# EAGLE design Breadboard_v11 (EAGLE 9.6.2)
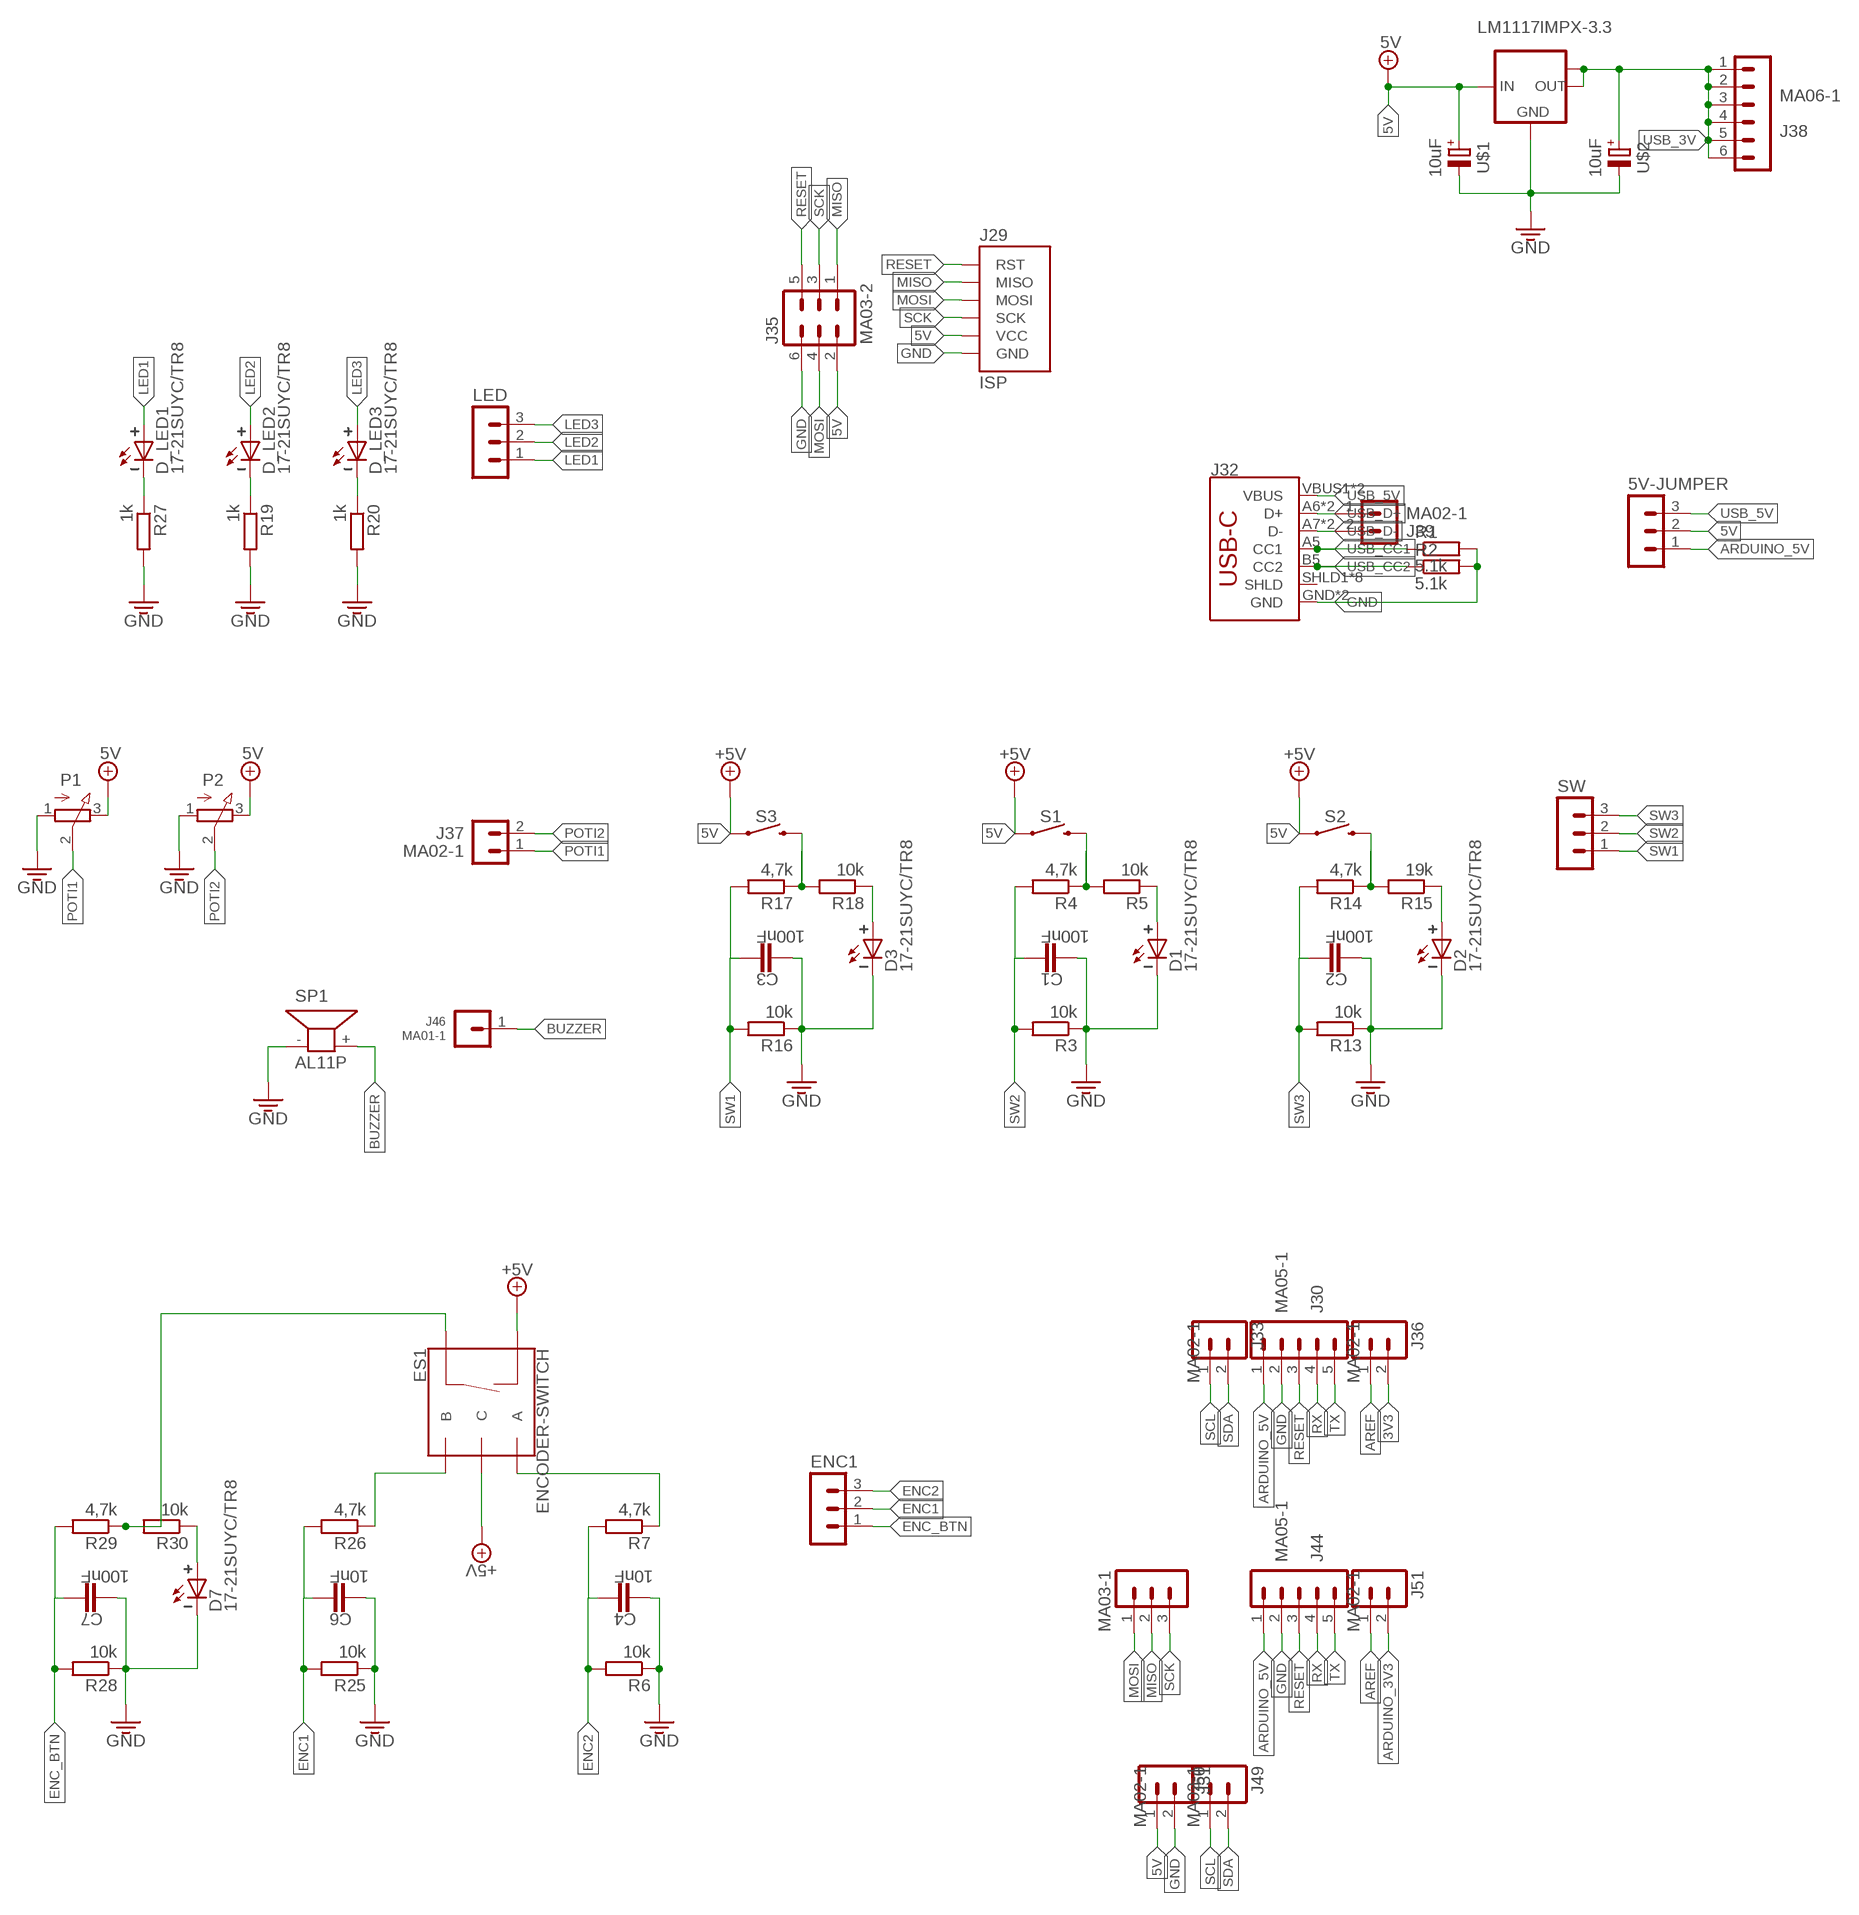
[diagram p0: schematic, sheet 1, part 1 of 2]
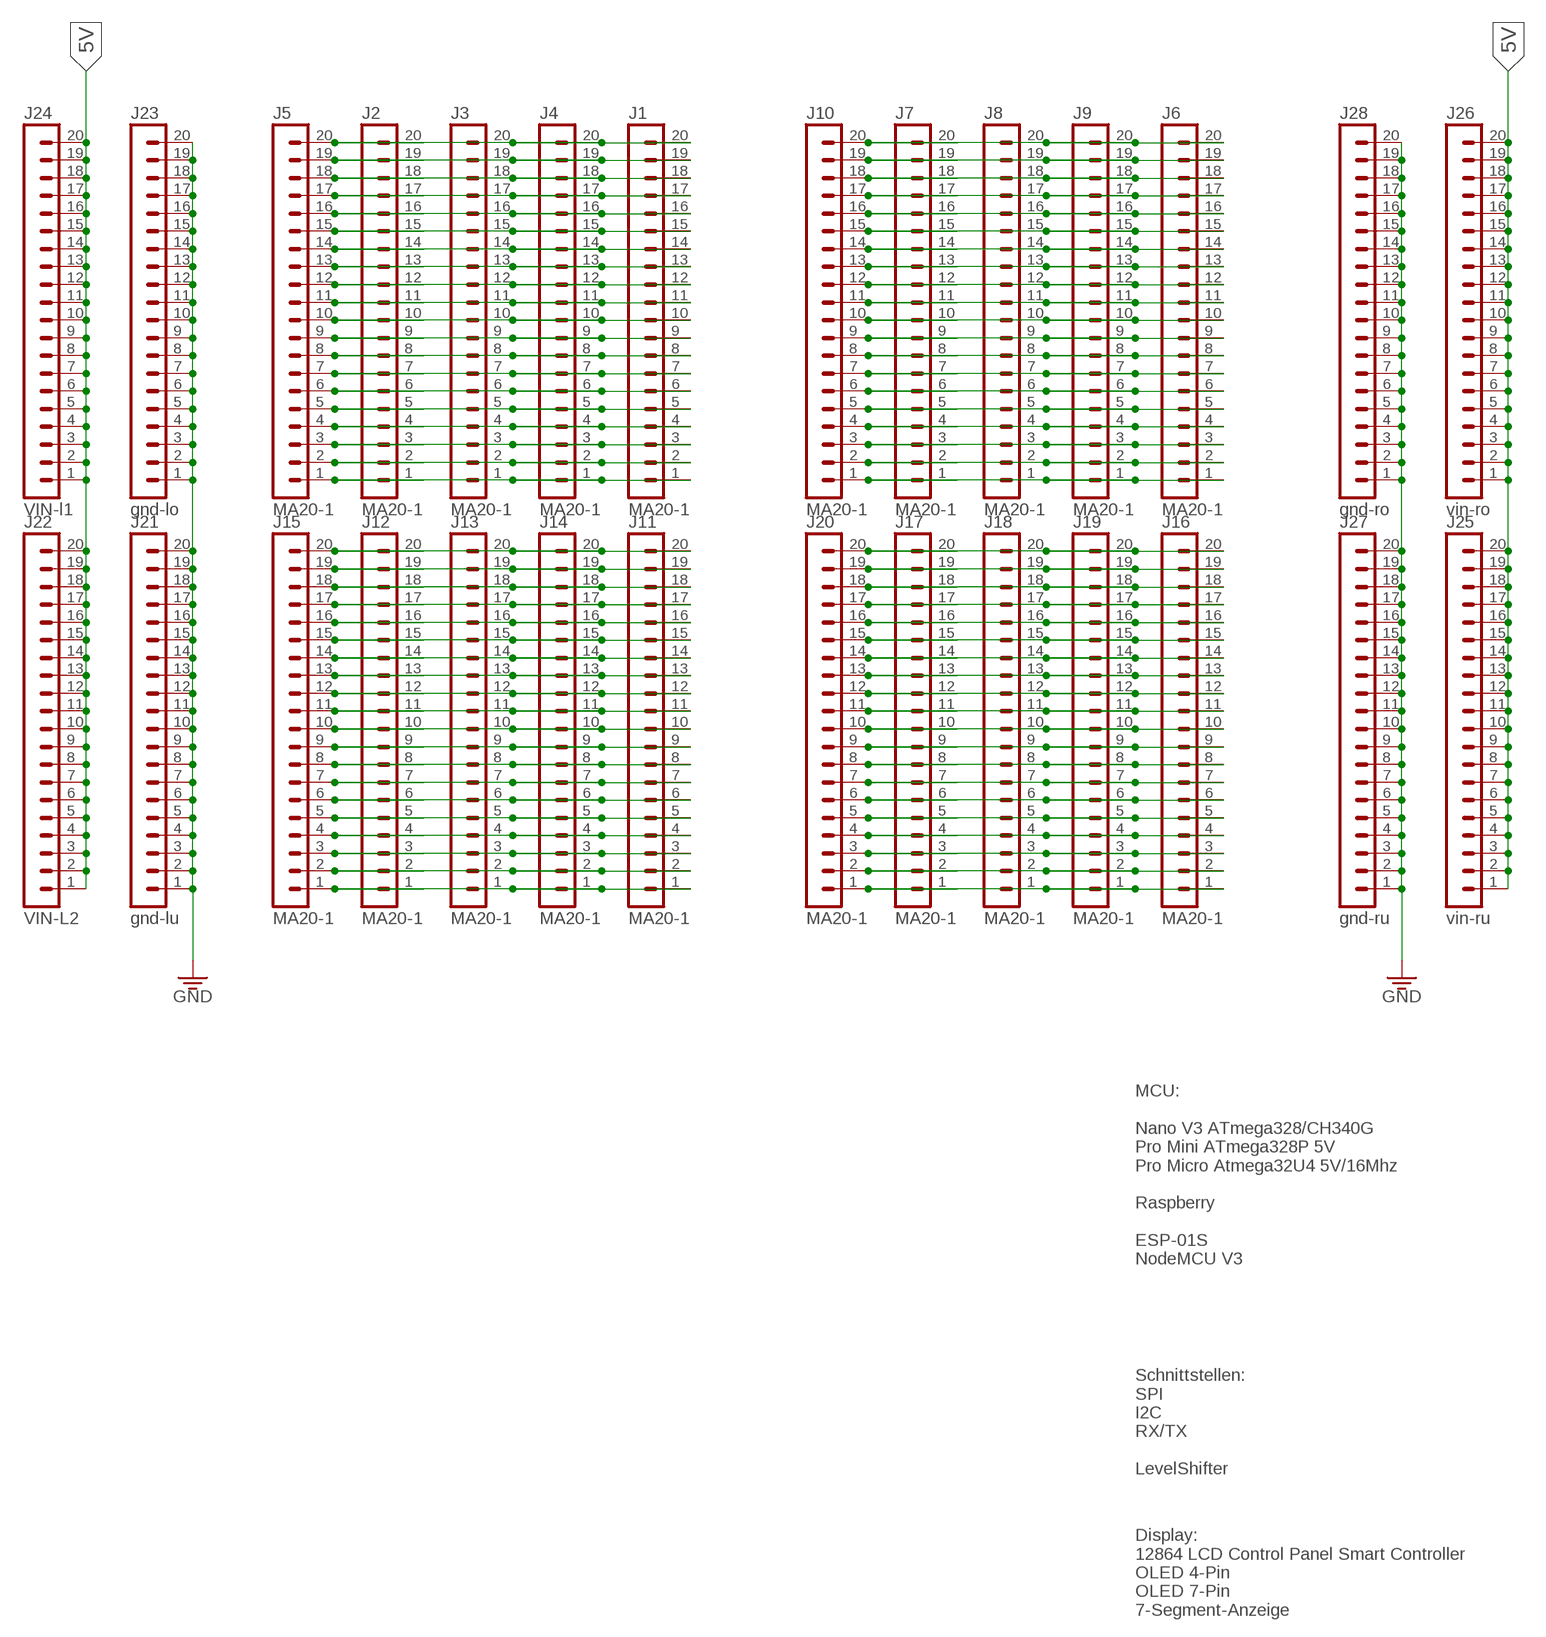
[diagram p1: schematic, sheet 1, part 2 of 2]

## Parts
5V-JUMPER  MA03-1  [MA03-1]
C1  100nF  C-EUC0805  [C0805]
C2  100nF  C-EUC0805  [C0805]
C3  100nF  C-EUC0805  [C0805]
C4  10nF  C-EUC0805  [C0805]
C6  10nF  C-EUC0805  [C0805]
C7  100nF  C-EUC0805  [C0805]
D1  17-21SUYC/TR8  LED-3MM  [LED_3MM]
D2  17-21SUYC/TR8  LED-3MM  [LED_3MM]
D3  17-21SUYC/TR8  LED-3MM  [LED_3MM]
D7  17-21SUYC/TR8  LED-3MM  [LED_3MM]
D_LED1  17-21SUYC/TR8  LED-3MM  [LED_3MM]
D_LED2  17-21SUYC/TR8  LED-3MM  [LED_3MM]
D_LED3  17-21SUYC/TR8  LED-3MM  [LED_3MM]
ENC1  MA03-1  [MA03-1]
ES1  ENCODER-SWITCH  [ROTARY_ENC_PLAIN]
IC2  LM1117IMPX-3.3  [SOT223]
J1  MA20-1  [MA20-1]
J2  MA20-1  [MA20-1]
J3  MA20-1  [MA20-1]
J4  MA20-1  [MA20-1]
J5  MA20-1  [MA20-1]
J6  MA20-1  [MA20-1]
J7  MA20-1  [MA20-1]
J8  MA20-1  [MA20-1]
J9  MA20-1  [MA20-1]
J10  MA20-1  [MA20-1]
J11  MA20-1  [MA20-1]
J12  MA20-1  [MA20-1]
J13  MA20-1  [MA20-1]
J14  MA20-1  [MA20-1]
J15  MA20-1  [MA20-1]
J16  MA20-1  [MA20-1]
J17  MA20-1  [MA20-1]
J18  MA20-1  [MA20-1]
J19  MA20-1  [MA20-1]
J20  MA20-1  [MA20-1]
J21  gnd-lu  MA20-1  [MA20-1]
J22  VIN-L2  MA20-1  [MA20-1]
J23  gnd-lo  MA20-1  [MA20-1]
J24  VIN-l1  MA20-1  [MA20-1]
J25  vin-ru  MA20-1  [MA20-1]
J26  vin-ro  MA20-1  [MA20-1]
J27  gnd-ru  MA20-1  [MA20-1]
J28  gnd-ro  MA20-1  [MA20-1]
J29  ISP  [ISP-2X3]
J30  MA05-1  [MA05-1]
J31  MA02-1  [MA02-1]
J32  USB_C16PIN  [USB-C-16P]
J33  MA02-1  [MA02-1]
J35  MA03-2  [MA03-2]
J36  MA02-1  [MA02-1]
J37  MA02-1  [MA02-1]
J38  MA06-1  [MA06-1]
J39  MA02-1  [MA02-1]
J44  MA05-1  [MA05-1]
J46  MA01-1  [MA01-1]
J49  MA02-1  [MA02-1]
J50  MA03-1  [MA03-1]
J51  MA02-1  [MA02-1]
LED  MA03-1  [MA03-1]
P1  3RP/1610N  [3RP/1610N]
P2  3RP/1610N  [3RP/1610N]
R1  5.1k  R-EU_R0805  [R0805]
R2  5.1k  R-EU_R0805  [R0805]
R3  10k  R-EU_R0805  [R0805]
R4  4,7k  R-EU_R0805  [R0805]
R5  10k  R-EU_R0805  [R0805]
R6  10k  R-EU_R0805  [R0805]
R7  4,7k  R-EU_R0805  [R0805]
R13  10k  R-EU_R0805  [R0805]
R14  4,7k  R-EU_R0805  [R0805]
R15  19k  R-EU_R0805  [R0805]
R16  10k  R-EU_R0805  [R0805]
R17  4,7k  R-EU_R0805  [R0805]
R18  10k  R-EU_R0805  [R0805]
R19  1k  R-EU_R0805  [R0805]
R20  1k  R-EU_R0805  [R0805]
R25  10k  R-EU_R0805  [R0805]
R26  4,7k  R-EU_R0805  [R0805]
R27  1k  R-EU_R0805  [R0805]
R28  10k  R-EU_R0805  [R0805]
R29  4,7k  R-EU_R0805  [R0805]
R30  10k  R-EU_R0805  [R0805]
S1  MOMENTARY-SWITCH-SPST-PTH-12MM  [TACTILE_SWITCH_PTH_12MM]
S2  MOMENTARY-SWITCH-SPST-PTH-12MM  [TACTILE_SWITCH_PTH_12MM]
S3  MOMENTARY-SWITCH-SPST-PTH-12MM  [TACTILE_SWITCH_PTH_12MM]
SP1  AL11P  [AL11P]
SW  MA03-1  [MA03-1]
U$1  10uF  TANTALUM_10UF_16V  [C3216]
U$2  10uF  TANTALUM_10UF_16V  [C3216]

## Nets
3V3: J36.2
5V: 5V-JUMPER.2 ES1.C ES1.SW- IC2.3(IN) J22.1 J22.2 J22.3 J22.4 J22.5 J22.6 J22.7 J22.8 J22.9 J22.10 J22.11 J22.12 J22.13 J22.14 J22.15 J22.16 J22.17 J22.18 J22.19 J22.20 J24.1 J24.2 J24.3 J24.4 J24.5 J24.6 J24.7 J24.8 J24.9 J24.10 J24.11 J24.12 J24.13 J24.14 J24.15 J24.16 J24.17 J24.18 J24.19 J24.20 J25.1 J25.2 J25.3 J25.4 J25.5 J25.6 J25.7 J25.8 J25.9 J25.10 J25.11 J25.12 J25.13 J25.14 J25.15 J25.16 J25.17 J25.18 J25.19 J25.20 J26.1 J26.2 J26.3 J26.4 J26.5 J26.6 J26.7 J26.8 J26.9 J26.10 J26.11 J26.12 J26.13 J26.14 J26.15 J26.16 J26.17 J26.18 J26.19 J26.20 J29.VCC J31.1 J35.2 P1.3(E) P2.3(E) S1.1 S2.1 S3.1 U$1.1(+) ; supply symbol labelled +5V
ARDUINO_3V3: J51.2
ARDUINO_5V: 5V-JUMPER.1 J30.1 J44.1
AREF: J36.1 J51.1
BUZZER: J46.1 SP1.+
ENC1: C6.1 ENC1.2 R25.2 R26.2
ENC2: C4.1 ENC1.3 R6.2 R7.2
ENC_BTN: C7.1 ENC1.1 R28.2 R29.2
GND: C1.2 C2.2 C3.2 C4.2 C6.2 C7.2 D1.C D2.C D3.C D7.C IC2.1(GND) J21.1 J21.2 J21.3 J21.4 J21.5 J21.6 J21.7 J21.8 J21.9 J21.10 J21.11 J21.12 J21.13 J21.14 J21.15 J21.16 J21.17 J21.18 J21.19 J21.20 J23.1 J23.2 J23.3 J23.4 J23.5 J23.6 J23.7 J23.8 J23.9 J23.10 J23.11 J23.12 J23.13 J23.14 J23.15 J23.16 J23.17 J23.18 J23.19 J23.20 J27.1 J27.2 J27.3 J27.4 J27.5 J27.6 J27.7 J27.8 J27.9 J27.10 J27.11 J27.12 J27.13 J27.14 J27.15 J27.16 J27.17 J27.18 J27.19 J27.20 J28.1 J28.2 J28.3 J28.4 J28.5 J28.6 J28.7 J28.8 J28.9 J28.10 J28.11 J28.12 J28.13 J28.14 J28.15 J28.16 J28.17 J28.18 J28.19 J28.20 J29.GND J30.2 J31.2 J32.GND J32.GND2(GND) J35.6 J44.2 P1.1(A) P2.1(A) R1.2 R2.2 R3.1 R6.1 R13.1 R16.1 R19.2 R20.2 R25.1 R27.2 R28.1 SP1.- U$1.2(-) U$2.2(-)
LED1: D_LED1.A LED.1
LED2: D_LED2.A LED.2
LED3: D_LED3.A LED.3
LED+_$1: D1.A R5.1
LED+_$2: D2.A R15.1
LED+_$3: D3.A R18.1
LED+_$7: D7.A R30.1
MISO: J29.MISO J35.1 J50.2
MOSI: J29.MOSI J35.4 J50.1
N$1: J1.1 J2.1 J3.1 J4.1 J5.1
N$2: J1.2 J2.2 J3.2 J4.2 J5.2
N$3: J1.3 J2.3 J3.3 J4.3 J5.3
N$4: J1.4 J2.4 J3.4 J4.4 J5.4
N$5: J1.5 J2.5 J3.5 J4.5 J5.5
N$6: J1.6 J2.6 J3.6 J4.6 J5.6
N$7: J1.7 J2.7 J3.7 J4.7 J5.7
N$8: J1.8 J2.8 J3.8 J4.8 J5.8
N$9: J1.9 J2.9 J3.9 J4.9 J5.9
N$10: J1.10 J2.10 J3.10 J4.10 J5.10
N$11: J1.11 J2.11 J3.11 J4.11 J5.11
N$12: J1.12 J2.12 J3.12 J4.12 J5.12
N$13: J1.13 J2.13 J3.13 J4.13 J5.13
N$14: J1.14 J2.14 J3.14 J4.14 J5.14
N$15: J1.15 J2.15 J3.15 J4.15 J5.15
N$16: J1.16 J2.16 J3.16 J4.16 J5.16
N$17: J1.17 J2.17 J3.17 J4.17 J5.17
N$18: J1.18 J2.18 J3.18 J4.18 J5.18
N$19: J1.19 J2.19 J3.19 J4.19 J5.19
N$20: J1.20 J2.20 J3.20 J4.20 J5.20
N$21: J6.1 J7.1 J8.1 J9.1 J10.1
N$22: J6.2 J7.2 J8.2 J9.2 J10.2
N$23: J6.3 J7.3 J8.3 J9.3 J10.3
N$24: J6.4 J7.4 J8.4 J9.4 J10.4
N$25: J6.5 J7.5 J8.5 J9.5 J10.5
N$26: J6.6 J7.6 J8.6 J9.6 J10.6
N$27: J6.7 J7.7 J8.7 J9.7 J10.7
N$28: J6.8 J7.8 J8.8 J9.8 J10.8
N$29: J6.9 J7.9 J8.9 J9.9 J10.9
N$30: J6.10 J7.10 J8.10 J9.10 J10.10
N$31: J6.11 J7.11 J8.11 J9.11 J10.11
N$32: J6.12 J7.12 J8.12 J9.12 J10.12
N$33: J6.13 J7.13 J8.13 J9.13 J10.13
N$34: J6.14 J7.14 J8.14 J9.14 J10.14
N$35: J6.15 J7.15 J8.15 J9.15 J10.15
N$36: J6.16 J7.16 J8.16 J9.16 J10.16
N$37: J6.17 J7.17 J8.17 J9.17 J10.17
N$38: J6.18 J7.18 J8.18 J9.18 J10.18
N$39: J6.19 J7.19 J8.19 J9.19 J10.19
N$40: J6.20 J7.20 J8.20 J9.20 J10.20
N$41: J11.1 J12.1 J13.1 J14.1 J15.1
N$42: J11.2 J12.2 J13.2 J14.2 J15.2
N$43: J11.3 J12.3 J13.3 J14.3 J15.3
N$44: J11.4 J12.4 J13.4 J14.4 J15.4
N$45: J11.5 J12.5 J13.5 J14.5 J15.5
N$46: J11.6 J12.6 J13.6 J14.6 J15.6
N$47: J11.7 J12.7 J13.7 J14.7 J15.7
N$48: J11.8 J12.8 J13.8 J14.8 J15.8
N$49: J11.9 J12.9 J13.9 J14.9 J15.9
N$50: J11.10 J12.10 J13.10 J14.10 J15.10
N$51: J11.11 J12.11 J13.11 J14.11 J15.11
N$52: J11.12 J12.12 J13.12 J14.12 J15.12
N$53: J11.13 J12.13 J13.13 J14.13 J15.13
N$54: J11.14 J12.14 J13.14 J14.14 J15.14
N$55: J11.15 J12.15 J13.15 J14.15 J15.15
N$56: J11.16 J12.16 J13.16 J14.16 J15.16
N$57: J11.17 J12.17 J13.17 J14.17 J15.17
N$58: J11.18 J12.18 J13.18 J14.18 J15.18
N$59: J11.19 J12.19 J13.19 J14.19 J15.19
N$60: J11.20 J12.20 J13.20 J14.20 J15.20
N$61: J16.1 J17.1 J18.1 J19.1 J20.1
N$62: J16.2 J17.2 J18.2 J19.2 J20.2
N$63: J16.3 J17.3 J18.3 J19.3 J20.3
N$64: J16.4 J17.4 J18.4 J19.4 J20.4
N$65: J16.5 J17.5 J18.5 J19.5 J20.5
N$66: J16.6 J17.6 J18.6 J19.6 J20.6
N$67: J16.7 J17.7 J18.7 J19.7 J20.7
N$68: J16.8 J17.8 J18.8 J19.8 J20.8
N$69: J16.9 J17.9 J18.9 J19.9 J20.9
N$70: J16.10 J17.10 J18.10 J19.10 J20.10
N$71: J16.11 J17.11 J18.11 J19.11 J20.11
N$72: J16.12 J17.12 J18.12 J19.12 J20.12
N$73: J16.13 J17.13 J18.13 J19.13 J20.13
N$74: J16.14 J17.14 J18.14 J19.14 J20.14
N$75: J16.15 J17.15 J18.15 J19.15 J20.15
N$76: J16.16 J17.16 J18.16 J19.16 J20.16
N$77: J16.17 J17.17 J18.17 J19.17 J20.17
N$78: J16.18 J17.18 J18.18 J19.18 J20.18
N$79: J16.19 J17.19 J18.19 J19.19 J20.19
N$80: J16.20 J17.20 J18.20 J19.20 J20.20
N$81: R4.1 R5.2 S1.3
N$82: R14.1 R15.2 S2.3
N$83: R17.1 R18.2 S3.3
N$84: D_LED1.C R27.1
N$85: D_LED2.C R19.1
N$87: D_LED3.C R20.1
N$127: ES1.A R7.1
N$129: ES1.B R26.1
N$130: ES1.SW+ R29.1 R30.2
POTI1: J37.1 P1.2(S)
POTI2: J37.2 P2.2(S)
RESET: J29.RST J30.3 J35.5 J44.3
RX: J30.4 J44.4
SCK: J29.SCK J35.3 J50.3
SCL: J33.1 J49.1
SDA: J33.2 J49.2
SW1: C3.1 R16.2 R17.2 SW.1
SW2: C1.1 R3.2 R4.2 SW.2
SW3: C2.1 R13.2 R14.2 SW.3
TX: J30.5 J44.5
USB_3V: IC2.2(OUT) IC2.TAB(OUT1) J38.1 J38.2 J38.3 J38.4 J38.5 J38.6 U$2.1(+)
USB_5V: 5V-JUMPER.3 J32.VBUS1(VBUS) J32.VBUS2(VBUS)
USB_CC1: J32.A5(CC1) R1.1
USB_CC2: J32.B5(CC2) R2.1
USB_D+: J32.A6(D+) J32.B6(D+) J39.1
USB_D-: J32.A7(D-) J32.B7(D-) J39.2
Unconnected: J32.SHLD1(SHLD) J32.SHLD2(SHLD) J32.SHLD3(SHLD) J32.SHLD4(SHLD) J32.SHLD5(SHLD) J32.SHLD6(SHLD) J32.SHLD7(SHLD) J32.SHLD8(SHLD)

## Notes on the sheet
- MCU:
  
  Nano V3 ATmega328/CH340G
  Pro Mini ATmega328P 5V
  Pro Micro Atmega32U4 5V/16Mhz
  
  Raspberry
  
  ESP-01S
  NodeMCU V3
- Schnittstellen:
  SPI
  I2C
  RX/TX
  
  LevelShifter
- Display:
  12864 LCD Control Panel Smart Controller
  OLED 4-Pin
  OLED 7-Pin
  7-Segment-Anzeige

## Library data of the parts
5V-JUMPER ENC1 LED SW = 00_marph_CON2:MA03-1: Pin Header
C1-C4 C6 C7 = resistor:C-EU: CAPACITOR, European symbol
D1-D3 D7 D_LED1-D_LED3 = 00_marph_LED:LED: LED red, green, blue -> 0603
ES1 = 00_SparkFun-Switches:ENCODER-SWITCH: Rotary Encoder w/ Select Switch Encoders rotate similarly to potentiometers, but they’re different from potentiometers in that an encoder has full rotation without limits. They output gray code so that you can tell how much and in which direction the encoder has been turned. This encoder includes a push-down select switch built into the shaft. SparkFun Products Rotary Encoder <https://www.sparkfun.com/products/9117> (COM-09117); SF_SKU: COM-09117
IC2 = 00_marph_spannungswandler:LM1117IMPX-*
J1-J28 = 00_marph_CON2:MA20-1: Pin Header
J29 = 00_we-board:ISP: AVR ISP connector
J30 J44 = 00_marph_CON_PinRows:MA05-1: Pin Header
J31 J33 J36 J49 J51 = 00_marph_connectors_IDC:MA02-1: Pin Header
J32 = 00_marph_CON1:USB_C: USB Type C 16Pin Connector Super Speed pins not available on the 16-pin purely SMD connector so this part is best for USB 2.0 implementations. D1 and D2 are tied together enabling D+/- no matter which way the cable is plugged into the connector. The two channel configuration pins (CC1/2) are exposed. These are normally connected to ground via 5.1k resistors but can be reconfigured for high current/high power applications.; PROD_ID: CONN-14122
J35 = 00_marph_CON2:MA03-2: Pin Header
J37 J39 = 00_marph_CON_PinRows:MA02-1: Pin Header
J38 = 00_marph_CON_PinRows:MA06-1: Pin Header
J46 = 00_marph_CON2:MA01-1: Pin Header
J50 = 00_marph_connectors_IDC:MA03-1: Pin Header
P1 P2 = pot:3RP/1610N: 16mm Potentiometer one level Source: http://www.alphapotentiometers.net/html/16mm_pot_2.html
R1 R2 R5 R15 R18-R20 R27 R30 = rcl:R-EU_: RESISTOR, European symbol; SPICEPREFIX: R
R3 R4 R6 R7 R13 R14 R16 R17 R25 R26 R28 R29 = resistor:R-EU_: RESISTOR, European symbol
S1-S3 = 00_SparkFun-Switches:MOMENTARY-SWITCH-SPST: Momentary Switch (Pushbutton) - SPST Normally-open (NO) SPST momentary switches (buttons, pushbuttons). Variants PTH-12MM - 12mm square, through-hole Momentary Pushbutton Switch - 12mm Square <https://www.sparkfun.com/products/9190> (COM-09190) PTH-6.0MM, PTH-6.0MM-KIT - 6.0mm square, through-hole Mini Pushbutton Switch <https://www.sparkfun.com/products/97> (COM-00097) KIT package intended for soldering kit's - only one side of pads' copper is exposed. PTH-RIGHT-ANGLE-KIT - Right-angle, through-hole Right Angle Tactile Button <https://www.sparkfun.com/products/10791> - Used on SparkFun BigTime Watch Kit <https://www.sparkfun.com/products/11734> SMD-12MM - 12mm square, surface-mount Tactile Button - SMD (12mm) <https://www.sparkfun.com/products/12993> (COM-12993) Used on SparkFun PicoBoard <https://www.sparkfun.com/products/11888> SMD-4.5MM - 4.5mm Square Trackball Switch Used on SparkFun Blackberry Trackballer Breakout <https://www.sparkfun.com/products/13169> SMD-4.6MMX2.8MM - 4.60mm x 2.80mm, surface mount Used on SparkFun SAMD21 Mini Breakout <https://www.sparkfun.com/products/13664> SMD-5.2MM, SMD-5.2-REDUNDANT - 5.2mm square, surface-mount Mini Pushbutton Switch - SMD <https://www.sparkfun.com/products/8720> (COM-08720) Used on Arduino Pro Mini <https://www.sparkfun.com/products/11114> REDUNDANT package connects both switch circuits together SMD-6.0X3.5MM - 6.0 x 3.5mm, surface mount Momentary Reset Switch SMD <https://www.sparkfun.com/products/8229> (COM-08229) SMD-6.2MM-TALL - 6.2mm square, surface mount Tactile Button - SMD (6mm) <https://www.sparkfun.com/products/12992> Used on SparkFun Digital Sandbox <https://www.sparkfun.com/products/12651> SMD-RIGHT-ANGLE - Right-angle, surface mount Used on SparkFun Block for Intel® Edison - Arduino <https://www.sparkfun.com/products/13036>; PROD_ID: SWCH-09185; SF_SKU: COM-09190
SP1 = buzzer:AL11P: SPEAKER Source: Buerklin; OC_FARNELL: unknown; OC_NEWARK: unknown
U$1 U$2 = 00_marph_capacitor:TANTALUM_10UF_16V: AVX TAJA106K016RNJ SMT CASE-A / EIA Metric: 3216 Tantalum Tantalum 10 uF 16 V 85° Celsius max. ESR 3 Ohm @100khz APPLICATIONS • General low power DC/DC and LDO Manufacturer: AVX MFR.Part #TAJA106K016RNJ LCSC Part # C7171 PackageCASE-A_3216 TANTALUM CAPACITORS 10UF 16V CASE-A_3216 ROHS Datasheet <https://datasheet.lcsc.com/szlcsc/AVX-TAJA106K016RNJ_C7171.pdf>

## Board
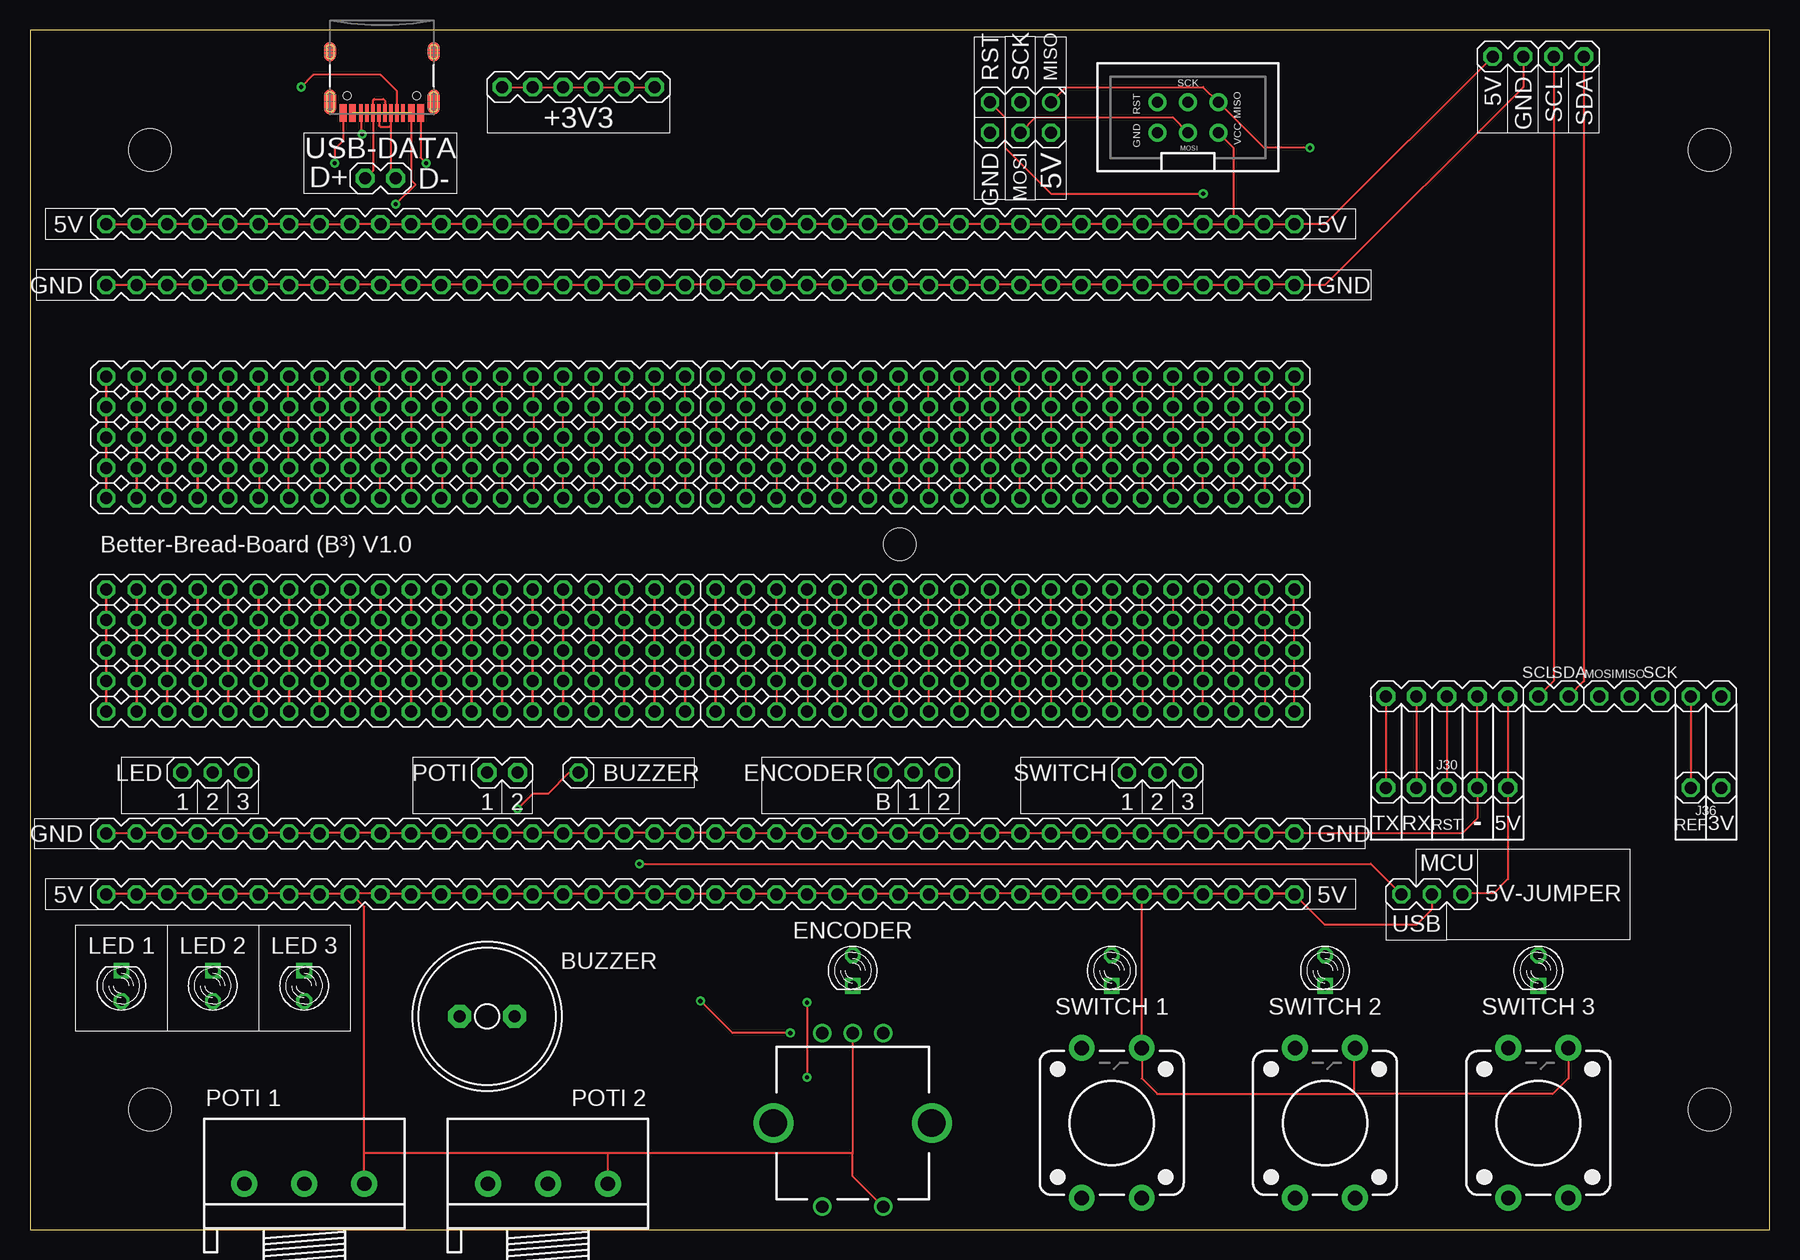
[diagram p2: board, top side]
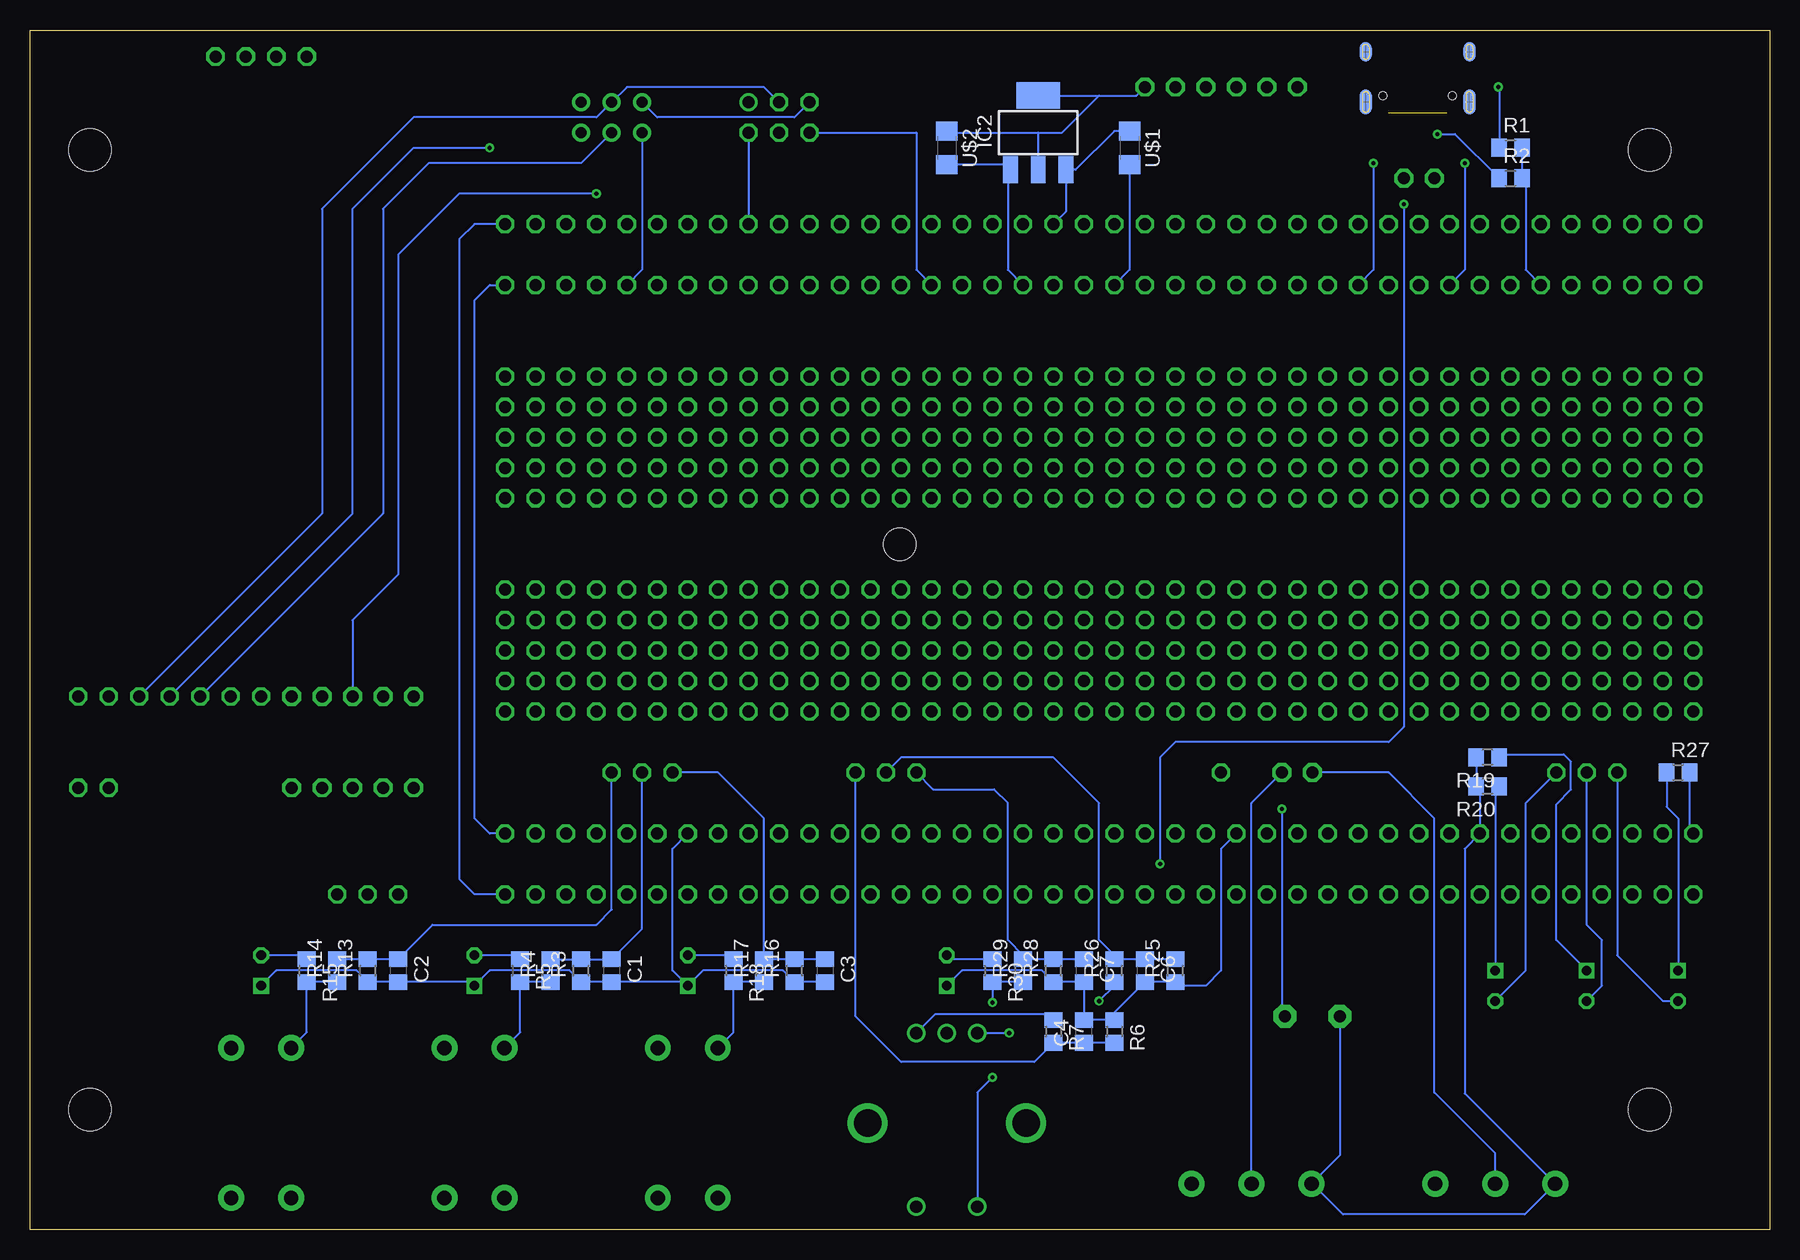
[diagram p3: board, bottom side, seen from below]

Size 145 x 100 mm. Coordinates in mm from the lower left corner, seen from the top.
Outline: 145,0 145,100 0,100 0,0 145,0
Copper layers (1*16): Top 0.035mm / dielectric 1.5mm / Bottom 0.035mm
Design rules "default": minimum track width 6mil, minimum drill 0.35mm, track to track 6mil, track to pad 6mil, pad to pad 6mil, via to via 6mil, smd to smd 6mil, copper to edge 40mil, drill to drill 6mil, minimum pad ring 10mil, minimum via ring 8mil, stop-mask expansion 4mil, vias tented up to drill 0mil, thermal gap 10mil
Holes 3.5 mm at 10,10 10,90 140,10 140,90
Holes 2.7 mm at 72.5,57.12

### Footprints (pad centres in the part's own frame; a part is rotated, then mirrored left to right if it is on the bottom)
MA03-1 = drill 1 octagon: 1 0,2.54; 2 0,0; 3 0,-2.54
C0805 = smd 1.3 x 1.5: 1 -0.95,0; 2 0.95,0
LED_3MM = drill 0.8 pad 1.3 octagon: A 0,-1.27 | drill 0.8 pad 1.3 square: C 0,1.27
ROTARY_ENC_PLAIN = drill 1.016: A 7.493,-2.54; B 7.493,2.54; C 7.493,0; SW+ -6.985,2.54; SW- -6.985,-2.54 | drill 2.286: P$3 0,6.604; P$4 0,-6.604
SOT223 = smd 1.219 x 2.235: 1 -2.311,-3.099; 2 0,-3.099; 3 2.311,-3.099 | smd 3.6 x 2.2: TAB 0,3.099
MA20-1 = drill 1 octagon: 1 0,24.13; 2 0,21.59; 3 0,19.05; 4 0,16.51; 5 0,13.97; 6 0,11.43; 7 0,8.89; 8 0,6.35; 9 0,3.81; 10 0,1.27; 11 0,-1.27; 12 0,-3.81; 13 0,-6.35; 14 0,-8.89; 15 0,-11.43; 16 0,-13.97; 17 0,-16.51; 18 0,-19.05; 19 0,-21.59; 20 0,-24.13
ISP-2X3 = drill 0.9 pad 1.5: GND 1.27,-2.54; MISO -1.27,2.54; MOSI 1.27,0; RST -1.27,-2.54; SCK -1.27,0; VCC 1.27,2.54
MA05-1 = drill 1 pad 1.575 octagon: 1 0,5.08; 2 0,2.54; 3 0,0; 4 0,-2.54; 5 0,-5.08
MA02-1 = drill 1 octagon: 1 0,1.27; 2 0,-1.27
USB-C-16P = smd 0.3 x 1.45: A5 -1.25,0; A6 -0.25,0; A7 0.25,0; A8 1.25,0; B5 1.75,0; B6 0.75,0; B7 -0.75,0; B8 -1.75,0 | smd 0.6 x 1.45: GND -3.225,0; GND2 3.225,0 | smd 1 x 2.1: SHLD1 -4.32,-0.915; SHLD2 4.32,-0.915 | smd 1 x 2.1 bottom: SHLD3 -4.32,-0.915; SHLD4 4.32,-0.915 | smd 1 x 1.6: SHLD5 -4.32,-5.095; SHLD8 4.32,-5.095 | smd 1 x 1.6 bottom: SHLD6 -4.32,-5.095; SHLD7 4.32,-5.095 | smd 0.55 x 1.45: VBUS1 -2.45,0; VBUS2 2.45,0 | hole 0.65: -2.89,-1.445; 2.89,-1.445
MA03-2 = drill 1: 1 -1.27,2.54 | drill 1 octagon: 2 1.27,2.54; 3 -1.27,0; 4 1.27,0; 5 -1.27,-2.54; 6 1.27,-2.54
MA02-1' = drill 1 pad 1.575 octagon: 1 0,1.27; 2 0,-1.27
MA06-1 = drill 1 pad 1.575 octagon: 1 0,6.35; 2 0,3.81; 3 0,1.27; 4 0,-1.27; 5 0,-3.81; 6 0,-6.35
MA01-1 = drill 1 octagon: 1 0,1.27
3RP/1610N = drill 1.2 pad 2.184: 1 -5,0; 2 0,0; 3 5,0
R0805 = smd 1.3 x 1.5: 1 -0.95,0; 2 0.95,0
TACTILE_SWITCH_PTH_12MM = drill 1.2 pad 2.159: 1 6.25,-2.5; 2 -6.25,-2.5; 3 6.25,2.5; 4 -6.25,2.5
AL11P = drill 1.016 pad 1.905 octagon: + 2.286,0; - -2.286,0
C3216 = smd 1.6 x 1.8: 1 -1.4,0; 2 1.4,0

### Placement (x,y rotation side)
5V-JUMPER  116.84,27.94 270 top
C1  96.52,21.59 270 bottom
C2  114.3,21.59 270 bottom
C3  78.74,21.59 270 bottom
C4  57.15,16.51 90 bottom
C6  52.07,21.59 270 bottom
C7  57.15,21.59 270 bottom
D1  107.95,21.59 180 top
D2  125.73,21.59 180 top
D3  90.17,21.59 180 top
D7  68.58,21.59 180 top
D_LED1  7.62,20.32 0 top
D_LED2  15.24,20.32 0 top
D_LED3  22.86,20.32 0 top
ENC1  73.66,38.1 90 top
ES1  68.58,8.89 90 top
IC2  60.96,91.44 0 bottom
J1  30.48,53.34 90 top
J2  30.48,50.8 90 top
J3  30.48,48.26 90 top
J4  30.48,45.72 90 top
J5  30.48,43.18 90 top
J6  30.48,60.96 90 top
J7  30.48,63.5 90 top
J8  30.48,66.04 90 top
J9  30.48,68.58 90 top
J10  30.48,71.12 90 top
J11  81.28,43.18 90 top
J12  81.28,45.72 90 top
J13  81.28,48.26 90 top
J14  81.28,50.8 90 top
J15  81.28,53.34 90 top
J16  81.28,60.96 90 top
J17  81.28,63.5 90 top
J18  81.28,66.04 90 top
J19  81.28,68.58 90 top
J20  81.28,71.12 90 top
J21  81.28,33.02 90 top
J22  81.28,27.94 90 top
J23  30.48,33.02 90 top
J24  30.48,27.94 90 top
J25  81.28,83.82 90 top
J26  30.48,83.82 90 top
J27  81.28,78.74 90 top
J28  30.48,78.74 90 top
J29  96.52,92.71 270 top
J30  118.11,36.83 270 top
J31  123.19,97.79 90 top
J32  29.34,93.09 180 top
J33  128.27,97.79 90 top
J35  82.55,92.71 270 top
J36  139.7,36.83 90 top
J37  MA02-1  [MA02-1']  39.37,38.1 90 top
J38  45.72,95.25 270 top
J39  MA02-1  [MA02-1']  29.21,87.63 90 top
J44  118.11,44.45 270 top
J46  45.72,36.83 0 top
J49  127,44.45 90 top
J50  133.35,44.45 90 top
J51  139.7,44.45 90 top
LED  15.24,38.1 90 top
P1  22.86,3.81 0 top
P2  43.18,3.81 0 top
R1  21.59,90.17 0 bottom
R2  21.59,87.63 0 bottom
R3  99.06,21.59 90 bottom
R4  101.6,21.59 90 bottom
R5  104.14,21.59 270 bottom
R6  54.61,16.51 270 bottom
R7  59.69,16.51 270 bottom
R13  116.84,21.59 90 bottom
R14  119.38,21.59 90 bottom
R15  121.92,21.59 270 bottom
R16  81.28,21.59 90 bottom
R17  83.82,21.59 90 bottom
R18  86.36,21.59 270 bottom
R19  23.5,39.37 180 bottom
R20  23.5,36.96 180 bottom
R25  49.53,21.59 90 bottom
R26  54.61,21.59 90 bottom
R27  7.62,38.1 0 bottom
R28  59.69,21.59 90 bottom
R29  62.23,21.59 90 bottom
R30  64.77,21.59 270 bottom
S1  107.95,8.89 90 top
S2  125.73,8.89 90 top
S3  90.17,8.89 90 top
SP1  38.1,17.78 0 top
SW  93.98,38.1 90 top
U$1  53.34,90.17 270 bottom
U$2  68.58,90.17 270 bottom

### Tracks (layer width: path | path; a pad name or v marks a point on that pad's centre or on a via)
5V
  Top 0.152: 31.75,28.04 29.31,28.04 J24.10 29.16,28.04 26.72,28.04 | 26.72,28.04 J24.9 26.57,28.04 24.13,28.04 | 24.13,28.04 21.69,28.04 J24.7 21.54,28.04 19.1,28.04 J24.6 18.95,28.04 16.51,28.04 | 24.13,28.04 J24.8 | 46.99,28.04 44.55,28.04 J24.16 44.4,28.04 41.96,28.04 J24.15 41.81,28.04 39.37,28.04 | 39.37,28.04 36.93,28.04 J24.13 36.78,28.04 34.34,28.04 J24.12 34.19,28.04 31.75,28.04 | 39.37,28.04 J24.14 | 62.23,28.04 59.79,28.04 J22.2 59.64,28.04 57.2,28.04 J22.1 57.05,28.04 54.61,28.04 | 54.61,28.04 52.17,28.04 J24.19 52.02,28.04 49.58,28.04 J24.18 49.43,28.04 46.99,28.04 | 54.61,28.04 J24.20 | 77.47,28.04 75.03,28.04 J22.8 74.88,28.04 72.44,28.04 J22.7 72.29,28.04 69.85,28.04 | 69.85,28.04 67.41,28.04 J22.5 67.26,28.04 64.82,28.04 J22.4 64.67,28.04 62.23,28.04 | 69.85,28.04 J22.6 | J22.20 105.36,28.04 102.92,28.04 J22.19 | 100.33,28.04 97.89,28.04 J22.17 97.74,28.04 95.3,28.04 J22.16 95.15,28.04 92.71,28.04 | 100.33,28.04 102.77,28.04 J22.19 | 100.33,28.04 J22.18 | 92.71,28.04 90.27,28.04 J22.14 90.12,28.04 87.68,28.04 J22.13 87.53,28.04 85.09,28.04 | 85.09,28.04 82.65,28.04 J22.11 82.5,28.04 80.06,28.04 J22.10 79.91,28.04 77.47,28.04 | 85.09,28.04 J22.12 | 92.71,28.04 J22.15 92.67,27.9 S3.1 92.67,12.6 93.97,11.3 110.36,11.3 | 77.47,28.04 J22.9 | 62.23,28.04 J22.3 | 46.99,28.04 J24.17 | 31.75,28.04 J24.11 | 16.51,28.04 14.07,28.04 J24.4 13.92,28.04 11.48,28.04 J24.3 11.33,28.04 8.89,28.04 | 8.89,28.04 6.45,28.04 J24.1 | 8.89,28.04 J24.2 | 16.51,28.04 J24.5 | J26.1 J26.2 J26.3 J26.4 J26.5 J26.6 J26.7 J26.8 J26.9 J26.10 J26.11 | J25.18 J25.17 J25.16 J25.15 J25.14 J25.13 J25.12 J25.11 J25.10 J25.9 J25.8 J25.7 J25.6 J25.5 J25.4 J25.3 J25.2 J25.1 J26.20 J26.19 J26.18 J26.17 J26.16 J26.15 J26.14 J26.13 J26.12 J26.11
  Top 0.152: J25.18 J25.19 J25.20 107.95,83.82 J31.1 | 31.79,83.86 J26.11 | 26.72,28.04 27.86,26.9 P1.3 27.86,6.35 48.18,6.35 | P2.3 48.18,6.35 | 68.58,6.35 48.18,6.35 | J22.20 105.54,28.07 103,28.07 J22.19 | 70.48,1.91 ES1.SW- 68.58,4.45 68.58,6.35 | ES1.C 68.58,6.35 | S2.1 128.23,12.6 126.93,11.3 110.36,11.3 | S1.1 110.36,15.05 110.36,11.3 | J29.VCC 100.33,90.17 J25.18 | 5V-JUMPER.2 116.84,26.67 115.57,25.4 107.95,25.4 J22.20
  Bottom 0.152: J35.2 J25.12 | J25.20 107.95,83.82 109.22,82.55 109.22,29.21 107.95,27.94 J22.20 | U$1.1 54.61,91.57 57.84,88.34 IC2.3 58.65,84.86 J25.2
ARDUINO_5V
  Top 0.152: J44.1 J30.1 123.19,29.21 122.05,28.07 119.51,28.07 5V-JUMPER.1
AREF
  Top 0.152: J51.1 J36.1
BUZZER  (via drill 0.35)
  Top 0.152: v40.64,35.05 41.91,36.32 43.18,36.32 44.96,38.1 J46.1
  Bottom 0.152: v40.64,35.05 40.64,18.03 SP1.+
ENC1
  Bottom 0.152: R25.2 C6.1 R26.2 54.61,22.86 55.88,24.13 55.88,35.56 59.69,39.37 72.39,39.37 ENC1.2
ENC2
  Bottom 0.152: ENC1.3 76.2,17.78 72.39,13.97 61.28,13.97 R7.2 C4.1 R6.2
ENC_BTN
  Bottom 0.152: C7.1 R28.2 R29.2 62.23,22.86 63.5,24.13 63.5,35.56 64.64,36.7 69.72,36.7 ENC1.1
GND  (via drill 0.35)
  Top 0.152: 24.13,78.79 21.69,78.79 J28.7 21.54,78.79 19.1,78.79 J28.6 18.95,78.79 16.51,78.79 | 8.89,78.79 6.45,78.79 J28.1 | 16.51,78.79 14.07,78.79 J28.4 13.92,78.79 11.48,78.79 J28.3 11.33,78.79 8.89,78.79 | 8.89,78.79 J28.2 | 16.51,78.79 J28.5 | 24.13,33.07 21.69,33.07 J23.7 21.54,33.07 19.1,33.07 J23.6 18.95,33.07 16.51,33.07 | 8.89,33.07 6.45,33.07 J23.1 | 16.51,33.07 14.07,33.07 J23.4 13.92,33.07 11.48,33.07 J23.3 11.33,33.07 8.89,33.07 | 8.89,33.07 J23.2 | 16.51,33.07 J23.5 | 39.37,78.79 36.93,78.79 J28.13 36.78,78.79 34.34,78.79 J28.12 34.19,78.79 31.75,78.79 | 31.75,78.79 29.31,78.79 J28.10 29.16,78.79 26.72,78.79 J28.9 26.57,78.79 24.13,78.79 | 31.75,78.79 J28.11 | 54.61,78.79 52.17,78.79 J28.19 52.02,78.79 49.58,78.79 J28.18 49.43,78.79 46.99,78.79 | 46.99,78.79 44.55,78.79 J28.16 44.4,78.79 41.96,78.79 J28.15 41.81,78.79 39.37,78.79 | 46.99,78.79 J28.17 | 69.85,78.79 67.41,78.79 J27.5 67.26,78.79 64.82,78.79 J27.4 64.67,78.79 62.23,78.79 | 62.23,78.79 59.79,78.79 J27.2 59.64,78.79 57.2,78.79 J27.1 57.05,78.79 54.61,78.79 | 62.23,78.79 J27.3 | 39.37,33.07 36.93,33.07 J23.13 36.78,33.07 34.34,33.07 J23.12 34.19,33.07 31.75,33.07 | 31.75,33.07 29.31,33.07 J23.10 29.16,33.07 26.72,33.07 J23.9 26.57,33.07 24.13,33.07 | 31.75,33.07 J23.11 | 85.09,78.79 82.65,78.79 J27.11 82.5,78.79 80.06,78.79 J27.10 79.91,78.79 77.47,78.79 | 77.47,78.79 75.03,78.79 J27.8 74.88,78.79 72.44,78.79 J27.7 72.29,78.79 69.85,78.79 | 77.47,78.79 J27.9 | 54.61,33.07 52.17,33.07 J23.19 52.02,33.07 49.58,33.07 J23.18 49.43,33.07 46.99,33.07 | 46.99,33.07 44.55,33.07 J23.16 44.4,33.07 41.96,33.07 J23.15 41.81,33.07 39.37,33.07
  Top 0.152: 46.99,33.07 J23.17 | 100.33,78.79 97.89,78.79 J27.17 97.74,78.79 95.3,78.79 J27.16 95.15,78.79 92.71,78.79 | 92.71,78.79 90.27,78.79 J27.14 90.12,78.79 87.68,78.79 J27.13 87.53,78.79 85.09,78.79 | 92.71,78.79 J27.15 | 69.85,33.07 67.41,33.07 J21.5 67.26,33.07 64.82,33.07 J21.4 64.67,33.07 62.23,33.07 | 62.23,33.07 59.79,33.07 J21.2 59.64,33.07 57.2,33.07 J21.1 57.05,33.07 54.61,33.07 | 62.23,33.07 J21.3 | 85.09,33.07 82.65,33.07 J21.11 82.5,33.07 80.06,33.07 J21.10 79.91,33.07 77.47,33.07 | 77.47,33.07 75.03,33.07 J21.8 74.88,33.07 72.44,33.07 J21.7 72.29,33.07 69.85,33.07 | 77.47,33.07 J21.9 | 100.33,33.07 97.89,33.07 J21.17 97.74,33.07 95.3,33.07 J21.16 95.15,33.07 92.71,33.07 | 92.71,33.07 90.27,33.07 J21.14 90.12,33.07 87.68,33.07 J21.13 87.53,33.07 85.09,33.07 | 92.71,33.07 J21.15 | 100.33,33.07 102.77,33.07 J21.19 102.92,33.07 105.36,33.07 J21.20 119.38,33.02 120.65,34.29 J30.2 J44.2 | 100.33,33.07 J21.18 | 85.09,33.07 J21.12 | 69.85,33.07 J21.6 | 100.33,78.79 102.77,78.79 J27.19 102.92,78.79 105.36,78.79 J27.20 107.95,78.74 124.46,95.25 J31.2 | 100.33,78.79 J27.18 | 54.61,33.07 J23.20 | 85.09,78.79 J27.12 | 39.37,33.07 J23.14 | 69.85,78.79 J27.6 | 54.61,78.79 J28.20 | 39.37,78.79 J28.14 | 24.13,33.07 J23.8 | 24.13,78.79 J28.8 | J32.GND 32.56,89.36 v33.02,88.9 | J32.GND2 26.11,90.75 25.4,90.04 v25.4,88.9
  Bottom 0.152: C3.2 R16.1 82.23,21.59 88.9,21.59 D3.C | D3.C 90.49,20.64 C1.2 R3.1 100.01,21.59 106.68,21.59 D1.C 108.27,20.64 C2.2 R13.1 117.79,21.59 124.46,21.59 D2.C | R27.2 6.67,33.34 J23.1 | R19.2 R20.2 24.13,36.64 J23.8 25.4,31.75 25.4,11.35 P1.1 20.4,1.27 35.56,1.27 38.14,3.85 | J27.6 71.12,80.01 71.12,91.44 J35.6 | J27.16 93.98,80.01 J29.GND | J21.20 106.68,33.02 107.95,34.29 107.95,77.47 106.68,78.74 J27.20 | SP1.- 35.81,6.18 38.14,3.85 | 38.14,3.85 P2.1 | J23.16 45.72,31.75 45.72,21.59 46.99,20.32 49.21,20.32 R25.1 C6.2 54.61,18.1 R6.1 C4.2 C7.2 R28.1 60.64,21.59 67.31,21.59 D7.C | D3.C 91.44,21.59 91.44,31.75 J21.14 | v33.02,88.9 33.02,80.01 J28.12 | v25.4,88.9 25.4,80.01 J28.9 | R1.2 R2.2 20.32,87.31 20.32,80.01 J28.6 | U$1.2 53.34,80.01 J28.20 | J27.3 63.5,80.01 63.5,88.11 IC2.1 63.7,88.77 U$2.2
LED1
  Bottom 0.152: LED.1 12.7,22.86 8.89,19.05 D_LED1.A
LED2
  Bottom 0.152: D_LED2.A 13.97,20.32 13.97,24.13 15.24,25.4 LED.2
LED3
  Bottom 0.152: D_LED3.A 20.32,21.59 20.32,35.56 LED.3
LED+_$1
  Bottom 0.152: R5.1 104.46,22.86 D1.A
LED+_$2
  Bottom 0.152: R15.1 122.24,22.86 D2.A
LED+_$3
  Bottom 0.152: R18.1 86.68,22.86 D3.A
LED+_$7
  Bottom 0.152: R30.1 68.26,22.54 D7.A
MISO  (via drill 0.35)
  Top 0.152: J35.1 86.36,95.25 97.79,95.25 J29.MISO 102.87,90.17 v106.68,90.17
  Bottom 0.152: J50.2 118.11,59.69 118.11,85.09 113.03,90.17 v106.68,90.17
MOSI
  Top 0.152: J35.4 83.82,92.71 95.25,92.71 J29.MOSI
  Bottom 0.152: J50.1 115.57,59.69 115.57,85.09 111.76,88.9 99.06,88.9 J29.MOSI
N$1
  Top 0.2: J1.1 J2.1 J3.1 J4.1 J5.1
N$2
  Top 0.2: J1.2 J2.2 J3.2 J4.2 J5.2
N$3
  Top 0.2: J1.3 J2.3 J3.3 J4.3 J5.3
N$4
  Top 0.2: J1.4 J2.4 J3.4 J4.4 J5.4
N$5
  Top 0.2: J1.5 J2.5 J3.5 J4.5 J5.5
N$6
  Top 0.2: J1.6 J2.6 J3.6 J4.6 J5.6
N$7
  Top 0.2: J1.7 J2.7 J3.7 J4.7 J5.7
N$8
  Top 0.2: J1.8 J2.8 J3.8 J4.8 J5.8
N$9
  Top 0.2: J1.9 J2.9 J3.9 J4.9 J5.9
N$10
  Top 0.2: J1.10 J2.10 J3.10 J4.10 J5.10
N$11
  Top 0.2: J1.11 J2.11 J3.11 J4.11 J5.11
N$12
  Top 0.2: J1.12 J2.12 J3.12 J4.12 J5.12
N$13
  Top 0.2: J1.13 J2.13 J3.13 J4.13 J5.13
N$14
  Top 0.2: J1.14 J2.14 J3.14 J4.14 J5.14
N$15
  Top 0.2: J1.15 J2.15 J3.15 J4.15 J5.15
N$16
  Top 0.2: J1.16 J2.16 J3.16 J4.16 J5.16
N$17
  Top 0.2: J1.17 J2.17 J3.17 J4.17 J5.17
N$18
  Top 0.2: J1.18 J2.18 J3.18 J4.18 J5.18
N$19
  Top 0.2: J1.19 J2.19 J3.19 J4.19 J5.19
N$20
  Top 0.2: J1.20 J2.20 J3.20 J4.20 J5.20
N$21
  Top 0.2: J6.1 J7.1 J8.1 J9.1 J10.1
N$22
  Top 0.2: J10.2 J9.2 J8.2 J7.2 J6.2
N$23
  Top 0.2: J6.3 J7.3 J8.3 J9.3 J10.3
N$24
  Top 0.2: J10.4 J9.4 J8.4 J7.4 J6.4
N$25
  Top 0.2: J6.5 J7.5 J8.5 J9.5 J10.5
N$26
  Top 0.152: J6.6 19.1,61.01 19.1,63.5 J7.6
  Top 0.2: J10.6 J9.6 J8.6 J7.6
N$27
  Top 0.152: 21.54,63.5 21.54,61.01 J6.7 | J10.7 21.54,71.12 21.54,68.63 J9.7 21.54,68.48 21.54,66.14 J8.7 21.54,65.99 21.54,63.5 | 21.54,63.5 J7.7
N$28
  Top 0.152: J6.8 J7.8 J8.8 J9.8 J10.8
N$29
  Top 0.152: 26.72,63.5 26.72,61.01 J6.9 | J10.9 26.72,71.12 26.72,68.63 J9.9 26.72,68.48 26.72,66.14 J8.9 26.72,65.99 26.72,63.5 | 26.72,63.5 J7.9
N$30
  Top 0.152: 29.16,63.5 29.16,61.01 J6.10 | J10.10 29.16,71.12 29.16,68.63 J9.10 29.16,68.48 29.16,66.14 J8.10 29.16,65.99 29.16,63.5 | 29.16,63.5 J7.10
N$31
  Top 0.152: J6.11 J7.11 J8.11 J9.11 J10.11
N$32
  Top 0.152: 34.34,63.5 34.34,61.01 J6.12 | J10.12 34.34,71.12 34.34,68.63 J9.12 34.34,68.48 34.34,66.14 J8.12 34.34,65.99 34.34,63.5 | 34.34,63.5 J7.12
N$33
  Top 0.152: 36.78,63.5 36.78,61.01 J6.13 | J10.13 36.78,71.12 36.78,68.63 J9.13 36.78,68.48 36.78,66.14 J8.13 36.78,65.99 36.78,63.5 | 36.78,63.5 J7.13
N$34
  Top 0.152: J6.14 J7.14 J8.14 J9.14 J10.14
N$35
  Top 0.152: 41.96,63.5 41.96,61.01 J6.15 | J10.15 41.96,71.12 41.96,68.63 J9.15 41.96,68.48 41.96,66.14 J8.15 41.96,65.99 41.96,63.5 | 41.96,63.5 J7.15
N$36
  Top 0.152: 44.4,63.5 44.4,61.01 J6.16 | J10.16 44.4,71.12 44.4,68.63 J9.16 44.4,68.48 44.4,66.14 J8.16 44.4,65.99 44.4,63.5 | 44.4,63.5 J7.16
N$37
  Top 0.152: J6.17 J7.17 J8.17 J9.17 J10.17
N$38
  Top 0.152: 49.58,63.5 49.58,61.01 J6.18 | J10.18 49.58,71.12 49.58,68.63 J9.18 49.58,68.48 49.58,66.14 J8.18 49.58,65.99 49.58,63.5 | 49.58,63.5 J7.18
N$39
  Top 0.152: 52.02,63.5 52.02,61.01 J6.19 | J10.19 52.02,71.12 52.02,68.63 J9.19 52.02,68.48 52.02,66.14 J8.19 52.02,65.99 52.02,63.5 | 52.02,63.5 J7.19
N$40
  Top 0.152: J6.20 J7.20 J8.20 J9.20 J10.20
N$41
  Top 0.2: J11.1 J12.1 J13.1 J14.1 J15.1
N$42
  Top 0.152: 59.64,45.72 59.64,43.28 J11.2 | J15.2 59.64,53.34 59.64,50.9 J14.2 59.64,50.75 59.64,48.31 J13.2 59.64,48.16 59.64,45.72 | 59.64,45.72 J12.2
N$43
  Top 0.152: J11.3 J12.3 J13.3 J14.3 J15.3
N$44
  Top 0.152: 64.82,45.72 64.82,43.28 J11.4 | J15.4 64.82,53.34 64.82,50.9 J14.4 64.82,50.75 64.82,48.31 J13.4 64.82,48.16 64.82,45.72 | 64.82,45.72 J12.4
N$45
  Top 0.152: 67.26,45.72 67.26,43.28 J11.5 | J15.5 67.26,53.34 67.26,50.9 J14.5 67.26,50.75 67.26,48.31 J13.5 67.26,48.16 67.26,45.72 | 67.26,45.72 J12.5
N$46
  Top 0.152: J11.6 J12.6 J13.6 J14.6 J15.6
N$47
  Top 0.152: 72.44,45.72 72.44,43.28 J11.7 | J15.7 72.44,53.34 72.44,50.9 J14.7 72.44,50.75 72.44,48.31 J13.7 72.44,48.16 72.44,45.72 | 72.44,45.72 J12.7
N$48
  Top 0.152: 74.88,45.72 74.88,43.28 J11.8 | J15.8 74.88,53.34 74.88,50.9 J14.8 74.88,50.75 74.88,48.31 J13.8 74.88,48.16 74.88,45.72 | 74.88,45.72 J12.8
N$49
  Top 0.152: J11.9 J12.9 J13.9 J14.9 J15.9
N$50
  Top 0.152: 80.06,45.72 80.06,43.28 J11.10 | J15.10 80.06,53.34 80.06,50.9 J14.10 80.06,50.75 80.06,48.31 J13.10 80.06,48.16 80.06,45.72 | 80.06,45.72 J12.10
N$51
  Top 0.152: 82.5,45.72 82.5,43.28 J11.11 | J15.11 82.5,53.34 82.5,50.9 J14.11 82.5,50.75 82.5,48.31 J13.11 82.5,48.16 82.5,45.72 | 82.5,45.72 J12.11
N$52
  Top 0.152: J11.12 J12.12 J13.12 J14.12 J15.12
N$53
  Top 0.152: 87.68,45.72 87.68,43.28 J11.13 | J15.13 87.68,53.34 87.68,50.9 J14.13 87.68,50.75 87.68,48.31 J13.13 87.68,48.16 87.68,45.72 | 87.68,45.72 J12.13
N$54
  Top 0.152: 90.12,45.72 90.12,43.28 J11.14 | J15.14 90.12,53.34 90.12,50.9 J14.14 90.12,50.75 90.12,48.31 J13.14 90.12,48.16 90.12,45.72 | 90.12,45.72 J12.14
N$55
  Top 0.152: J11.15 J12.15 J13.15 J14.15 J15.15
N$56
  Top 0.152: 95.3,45.72 95.3,43.28 J11.16 | J15.16 95.3,53.34 95.3,50.9 J14.16 95.3,50.75 95.3,48.31 J13.16 95.3,48.16 95.3,45.72 | 95.3,45.72 J12.16
N$57
  Top 0.152: 97.74,45.72 97.74,43.28 J11.17 | J15.17 97.74,53.34 97.74,50.9 J14.17 97.74,50.75 97.74,48.31 J13.17 97.74,48.16 97.74,45.72 | 97.74,45.72 J12.17
N$58
  Top 0.152: J11.18 J12.18 J13.18 J14.18 J15.18
N$59
  Top 0.152: 102.92,45.72 102.92,43.28 J11.19 | J15.19 102.92,53.34 102.92,50.9 J14.19 102.92,50.75 102.92,48.31 J13.19 102.92,48.16 102.92,45.72 | 102.92,45.72 J12.19
N$60
  Top 0.152: 105.36,45.72 105.36,43.28 J11.20 | J15.20 105.36,53.34 105.36,50.9 J14.20 105.36,50.75 105.36,48.31 J13.20 105.36,48.16 105.36,45.72 | 105.36,45.72 J12.20
N$61
  Top 0.152: 57.2,63.5 57.2,61.06 J16.1 | J20.1 57.2,71.12 57.2,68.68 J19.1 57.2,68.53 57.2,66.09 J18.1 57.2,65.94 57.2,63.5 | 57.2,63.5 J17.1
N$62
  Top 0.152: 59.64,63.5 59.64,61.06 J16.2 | J20.2 59.64,71.12 59.64,68.68 J19.2 59.64,68.53 59.64,66.09 J18.2 59.64,65.94 59.64,63.5 | 59.64,63.5 J17.2
N$63
  Top 0.152: J16.3 J17.3 J18.3 J19.3 J20.3
N$64
  Top 0.152: 64.82,63.5 64.82,61.06 J16.4 | J20.4 64.82,71.12 64.82,68.68 J19.4 64.82,68.53 64.82,66.09 J18.4 64.82,65.94 64.82,63.5 | 64.82,63.5 J17.4
N$65
  Top 0.152: 67.26,63.5 67.26,61.06 J16.5 | J20.5 67.26,71.12 67.26,68.68 J19.5 67.26,68.53 67.26,66.09 J18.5 67.26,65.94 67.26,63.5 | 67.26,63.5 J17.5
N$66
  Top 0.152: J16.6 J17.6 J18.6 J19.6 J20.6
N$67
  Top 0.152: 72.44,63.5 72.44,61.06 J16.7 | J20.7 72.44,71.12 72.44,68.68 J19.7 72.44,68.53 72.44,66.09 J18.7 72.44,65.94 72.44,63.5 | 72.44,63.5 J17.7
N$68
  Top 0.152: 74.88,63.5 74.88,61.06 J16.8 | J20.8 74.88,71.12 74.88,68.68 J19.8 74.88,68.53 74.88,66.09 J18.8 74.88,65.94 74.88,63.5 | 74.88,63.5 J17.8
N$69
  Top 0.152: J16.9 J17.9 J18.9 J19.9 J20.9
N$70
  Top 0.152: 80.06,63.5 80.06,61.06 J16.10 | J20.10 80.06,71.12 80.06,68.68 J19.10 80.06,68.53 80.06,66.09 J18.10 80.06,65.94 80.06,63.5 | 80.06,63.5 J17.10
N$71
  Top 0.152: 82.5,63.5 82.5,61.06 J16.11 | J20.11 82.5,71.12 82.5,68.68 J19.11 82.5,68.53 82.5,66.09 J18.11 82.5,65.94 82.5,63.5 | 82.5,63.5 J17.11
N$72
  Top 0.152: J16.12 J17.12 J18.12 J19.12 J20.12
N$73
  Top 0.152: 87.68,61.01 87.68,60.96 | 87.68,66.09 87.68,63.55 | 87.68,65.99 J18.13 | J20.13 87.68,71.12 87.68,68.63 J19.13 87.68,68.53 87.68,66.09 | 87.68,63.5 87.68,65.94 J18.13 | 87.68,63.5 J17.13 J18.13 | J16.13 87.68,61.01 | 87.68,61.01 87.68,63.5 | J18.13 87.68,66.09
N$74
  Top 0.152: J19.14 90.12,68.53 90.12,63.55 J17.14 90.12,63.5 | 90.12,66.14 90.12,71.12 J20.14 J19.14 | J19.14 90.12,68.58 | 90.12,63.5 90.12,65.94 J18.14 J19.14 | J16.14 90.12,61.01 90.12,63.5
N$75
  Top 0.152: J16.15 J17.15 J18.15 J19.15 J20.15
N$76
  Top 0.152: 95.3,65.99 J18.16 | J20.16 95.3,71.12 95.3,68.63 J19.16 95.3,68.53 95.3,66.09 | 95.3,63.5 95.3,65.94 J18.16 | 95.3,63.5 J17.16 95.3,63.55 95.3,66.09 | J16.16 95.3,61.01 95.3,63.5 | J18.16 95.3,66.09
N$77
  Top 0.152: 97.74,60.96 97.74,63.5 J17.17 | 97.74,68.53 97.74,66.09 | 97.74,65.99 J18.17 | 97.74,68.53 J19.17 | 97.74,68.53 97.74,68.63 | J20.17 97.74,71.12 97.74,68.63 | J19.17 97.74,68.58 | 97.74,63.4 97.74,61.06 J16.17 J17.17 | 97.74,65.94 J18.17 | J18.17 97.74,66.09 | J17.17 97.74,63.55 97.74,66.09 | J18.17 J19.17 | J19.17 97.74,68.63
N$78
  Top 0.152: J16.18 J17.18 J18.18 J19.18 J20.18
N$79
  Top 0.152: 102.92,60.96 102.92,63.5 J17.19 J18.19 | 102.92,65.99 J18.19 | J19.19 102.92,68.53 102.92,61.01 J16.19 102.92,61.06 102.92,63.4 | 102.92,68.58 102.92,68.63 | J20.19 102.92,71.12 102.92,68.63 | J19.19 102.89,68.6 102.92,68.58 | 102.92,65.94 J18.19 | J18.19 102.92,66.09 102.92,68.58 | J19.19 102.92,68.63
N$80
  Top 0.152: 105.36,63.5 105.36,60.96 | 105.36,65.99 J18.20 | J19.20 105.36,68.53 105.36,63.55 J17.20 | 105.36,68.58 105.36,68.63 | J20.20 105.36,71.12 105.36,68.63 | J19.20 105.39,68.6 105.36,68.58 | 105.36,63.5 105.36,65.94 J18.20 | 105.36,63.5 J17.20 | J18.20 105.36,66.09 105.36,68.58 | J19.20 105.36,68.63 | J17.20 J16.20
N$81
  Bottom 0.152: R4.1 R5.2 104.14,16.45 S1.3
N$82
  Bottom 0.152: S2.3 121.92,16.45 R15.2 R14.1
N$83
  Bottom 0.152: R17.1 R18.2 86.36,16.45 S3.3
N$84
  Bottom 0.152: R27.1 8.57,35.24 7.62,34.29 D_LED1.C
N$85
  Bottom 0.152: D_LED2.C 17.78,24.13 17.78,35.43 16.54,36.67 16.54,39.02 17.15,39.62 22.29,39.62 R19.1
N$87
  Bottom 0.152: R20.1 22.86,36.64 D_LED3.C
N$127
  Bottom 0.152: R7.1 60.2,17.97 69.53,17.97 ES1.A
N$129  (via drill 0.35)
  Top 0.152: v63.37,16.38 58.55,16.38 v55.88,19.05
  Bottom 0.152: ES1.B v63.37,16.38 | v55.88,19.05 54.61,20.32 R26.1
N$130  (via drill 0.35)
  Top 0.152: v64.77,18.92 v64.77,12.7
  Bottom 0.152: R29.1 R30.2 v64.77,18.92 | v64.77,12.7 66.04,11.43 ES1.SW+
POTI1
  Bottom 0.152: P1.2 22.86,6.35 27.94,11.43 27.94,34.29 31.75,38.1 J37.1
POTI2
  Bottom 0.152: P2.2 43.18,35.56 J37.2
RESET  (via drill 0.35)
  Top 0.152: J44.3 J30.3 | J35.5 81.28,92.71 81.28,90.17 85.09,86.36 v97.79,86.36
  Bottom 0.152: J35.5 81.28,92.71 92.71,92.71 J29.RST | v97.79,86.36 109.22,86.36 114.3,81.28 114.3,54.61 118.11,50.8 J44.3
RX
  Top 0.152: J44.4 J30.4
SCK
  Bottom 0.152: J50.3 120.65,59.69 120.65,85.09 113.03,92.71 97.79,92.71 J29.SCK 95.25,95.25 83.82,95.25 J35.3
SCL
  Top 0.152: J33.1 127,45.72 J49.1
SDA
  Top 0.152: J33.2 129.54,45.72 J49.2
SW1
  Bottom 0.152: C3.1 R16.2 R17.2 83.82,34.29 87.63,38.1 SW.1
SW2
  Bottom 0.152: R4.2 R3.2 C1.1 93.98,25.08 SW.2
SW3
  Bottom 0.152: R14.2 R13.2 C2.1 111.44,25.4 97.79,25.4 96.52,26.67 SW.3
TX
  Top 0.152: J44.5 J30.5
USB_3V
  Top 0.152: J38.6 J38.5 J38.4 J38.3 J38.2 J38.1
  Bottom 0.152: U$2.1 68.45,91.44 60.96,91.44 | 60.96,91.44 IC2.2 | IC2.TAB 55.88,94.54 | 55.88,94.54 52.78,94.54 J38.1 | 60.96,91.44 58.98,91.44 55.88,94.54
USB_5V  (via drill 0.35)  (1 unrouted)
  Top 0.152: J32.VBUS1 31.79,87.47 32.13,87.12 v30.48,85.47 | v50.8,30.48 111.76,30.48 5V-JUMPER.3
  Bottom 0.152: v30.48,85.47 30.48,41.91 31.75,40.64 49.53,40.64 50.8,39.37 v50.8,30.48
USB_CC1  (via drill 0.35)
  Top 0.152: J32.A5 30.59,94.89 29.21,96.27 23.62,96.27 v22.61,95.25
  Bottom 0.152: v22.61,95.25 22.54,95.18 R1.1
USB_CC2  (via drill 0.35)
  Top 0.152: J32.B5 27.59,91.67 27.69,91.57 v27.69,91.31
  Bottom 0.152: v27.69,91.31 26.22,91.31 R2.1
USB_D+
  Top 0.152: J32.A6 29.59,93.98 29.59,94.11 29.46,94.23 28.7,94.23 28.59,94.12 J32.B6 28.59,88.28 J39.1
USB_D-
  Top 0.152: J32.A7 29.09,92.08 29.08,92.08 29.21,91.95 29.97,91.95 30.09,92.06 | 30.09,92.06 J32.B7 | J39.2 30.09,88.02 30.09,92.06

### Text on the board
tNames: RST | SCK | MISO | 5V | GND | SCL | SDA | +3V3 | USB-DATA | GND | MOSI | 5V | D+ | D- | 5V | 5V | GND | GND | Better-Bread-Board (B³) V1.0 | SCL | SDA | MOSI | MISO | SCK | LED | POTI | BUZZER | ENCODER | SWITCH | 1 | 2 | 3 | 1 | 2 | B | 1 | 2 | 1 | 2 | 3 | - | GND | GND | TX | RX | RST | 5V | REF | 3V | MCU | 5V | 5V | 5V-JUMPER | USB | ENCODER | LED 1 | LED 2 | LED 3 | BUZZER | SWITCH 1 | SWITCH 2 | SWITCH 3 | POTI 1 | POTI 2